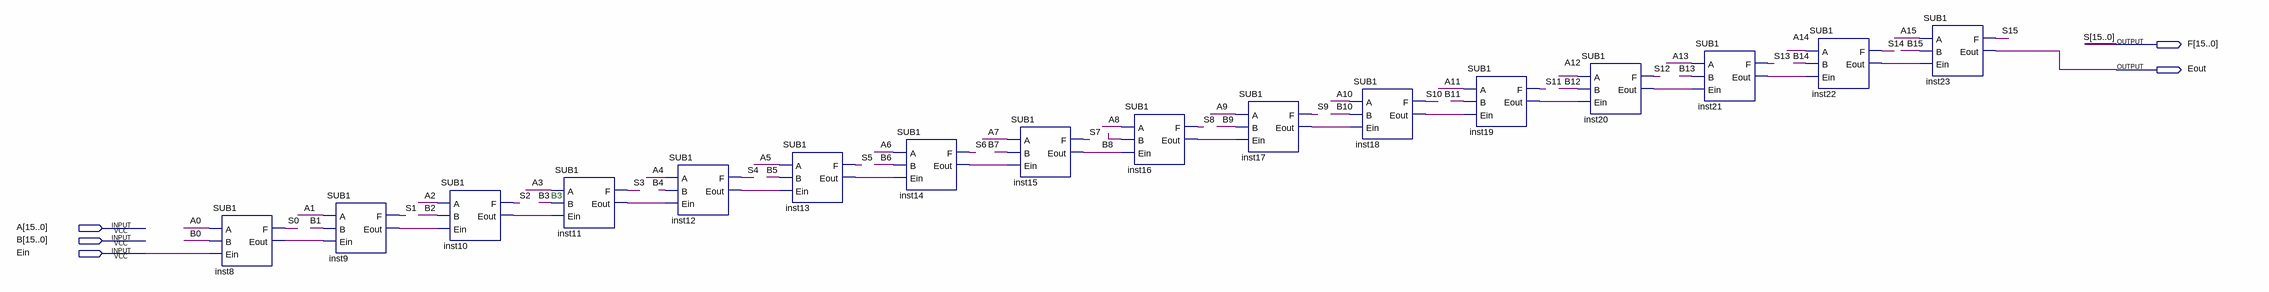
[diagram p0: schematic sheet]
// Quartus schematic SUB16.bdf as structural Verilog: 16 symbols, 5 pins
module SUB16 (
  input  [15:0] A,
  input  [15:0] B,
  input  Ein,
  output [15:0] F,
  output Eout
);

  wire inst8_eout, inst9_eout, inst10_eout, inst11_eout, inst12_eout, inst13_eout, inst14_eout, inst15_eout,
       inst16_eout, inst17_eout, inst18_eout, inst19_eout, inst20_eout, inst21_eout, inst22_eout;

  SUB1 inst8 (.A(A[0]), .B(B[0]), .Ein(Ein), .F(F[0]), .Eout(inst8_eout));
  SUB1 inst9 (.A(A[1]), .B(B[1]), .Ein(inst8_eout), .F(F[1]), .Eout(inst9_eout));
  SUB1 inst10 (.A(A[2]), .B(B[2]), .Ein(inst9_eout), .F(F[2]), .Eout(inst10_eout));
  SUB1 inst11 (.A(A[3]), .B(B[3]), .Ein(inst10_eout), .F(F[3]), .Eout(inst11_eout));
  SUB1 inst12 (.A(A[4]), .B(B[4]), .Ein(inst11_eout), .F(F[4]), .Eout(inst12_eout));
  SUB1 inst13 (.A(A[5]), .B(B[5]), .Ein(inst12_eout), .F(F[5]), .Eout(inst13_eout));
  SUB1 inst14 (.A(A[6]), .B(B[6]), .Ein(inst13_eout), .F(F[6]), .Eout(inst14_eout));
  SUB1 inst15 (.A(A[7]), .B(B[7]), .Ein(inst14_eout), .F(F[7]), .Eout(inst15_eout));
  SUB1 inst16 (.A(A[8]), .B(B[8]), .Ein(inst15_eout), .F(F[8]), .Eout(inst16_eout));
  SUB1 inst17 (.A(A[9]), .B(B[9]), .Ein(inst16_eout), .F(F[9]), .Eout(inst17_eout));
  SUB1 inst18 (.A(A[10]), .B(B[10]), .Ein(inst17_eout), .F(F[10]), .Eout(inst18_eout));
  SUB1 inst19 (.A(A[11]), .B(B[11]), .Ein(inst18_eout), .F(F[11]), .Eout(inst19_eout));
  SUB1 inst20 (.A(A[12]), .B(B[12]), .Ein(inst19_eout), .F(F[12]), .Eout(inst20_eout));
  SUB1 inst21 (.A(A[13]), .B(B[13]), .Ein(inst20_eout), .F(F[13]), .Eout(inst21_eout));
  SUB1 inst22 (.A(A[14]), .B(B[14]), .Ein(inst21_eout), .F(F[14]), .Eout(inst22_eout));
  SUB1 inst23 (.A(A[15]), .B(B[15]), .Ein(inst22_eout), .F(F[15]), .Eout(Eout));

  // Other names for the same wires on the sheet: S[15:0] = F; S0 = F[0]; S1 = F[1]; S2 = F[2]; S3 = F[3]; S4 = F[4];
  //   S5 = F[5]; S6 = F[6]; S7 = F[7]; S8 = F[8]; S9 = F[9]; S10 = F[10]; S11 = F[11]; S12 = F[12]; S13 = F[13];
  //   S14 = F[14]; S15 = F[15]

  // Notes on the sheet:
  //   B3
endmodule
